# EAGLE schematic Ferrofluid Speaker v27 (EAGLE 9.7.0)
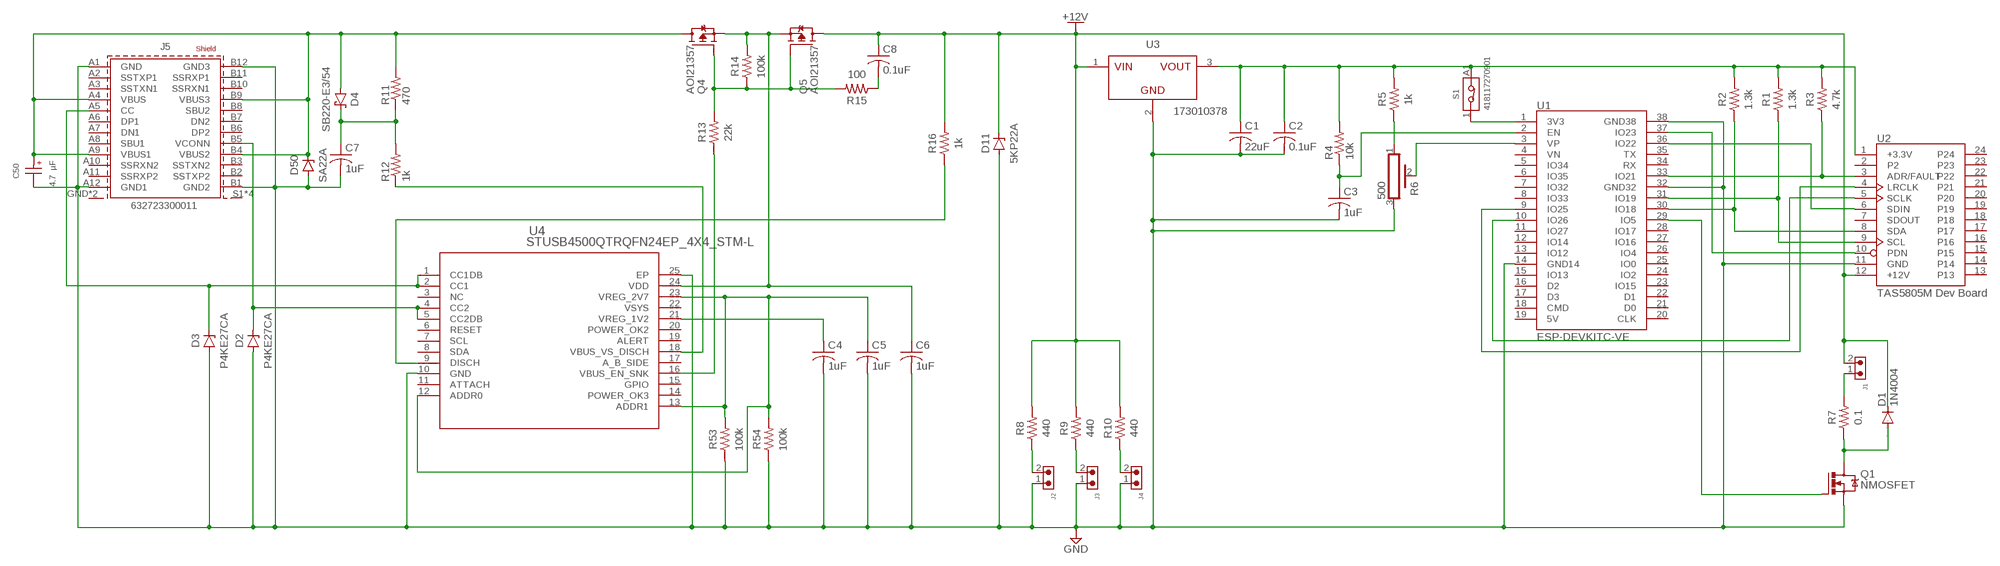
[diagram p0: schematic, sheet 1]

## Parts
C1  22uF  C-US025-024X044  [C025-024X044]
C2  0.1uF  C-US025-024X044  [C025-024X044]
C3  1uF  C-US025-024X044  [C025-024X044]
C4  1uF  C-US025-024X044  [C025-024X044]
C5  1uF  C-US025-024X044  [C025-024X044]
C6  1uF  C-US025-024X044  [C025-024X044]
C7  1uF  C-US025-024X044  [C025-024X044]
C8  0.1uF  C-US025-024X044  [C025-024X044]
C50  4.7 µF  WCAP-ATG8_5X11_860010472001  [WCAP-ATG8_5X11(DXL)]
D1  1N4004  [DO41-10]
D2  P4KE27CA  ZENERDO-214AB(SMC)  [DIOM7959X625N]
D3  P4KE27CA  ZENERDO-214AB(SMC)  [DIOM7959X625N]
D4  SB220-E3/54  SCHOTTKY_MBR0520LT1GDO-219  [SODFL3718X115]
D11  5KP22A  ZENERDO-214AB(SMC)  [DIOM7959X625N]
D50  SA22A  ZENERDO-214AB(SMC)  [DIOM7959X625N]
J1  6490XX11122_64900211122  [64900211122]
J2  6490XX11122_64900211122  [64900211122]
J3  6490XX11122_64900211122  [64900211122]
J4  6490XX11122_64900211122  [64900211122]
J5  632723300011  632723300011  [632723300011]
Q1  NMOSFET  NMOSFET_TO220  [TO220BV]
Q4  AOI21357  SPP80P06P  [TO220]
Q5  AOI21357  SPP80P06P  [TO220]
R1  1.3k  R-US_AXIAL-7.2MM-PITCH  [RESAD724W46L381D178B]
R2  1.3k  R-US_AXIAL-7.2MM-PITCH  [RESAD724W46L381D178B]
R3  4.7k  R-US_AXIAL-7.2MM-PITCH  [RESAD724W46L381D178B]
R4  10k  R-US_0204/5  [0204/5]
R5  1k  R-US_AXIAL-7.2MM-PITCH  [RESAD724W46L381D178B]
R6  500  PV36Z  [PV36Z]
R7  0.1  R-US_AXIAL-7.2MM-PITCH  [RESAD724W46L381D178B]
R8  440  R-US_AXIAL-7.2MM-PITCH  [RESAD724W46L381D178B]
R9  440  R-US_AXIAL-7.2MM-PITCH  [RESAD724W46L381D178B]
R10  440  R-US_AXIAL-7.2MM-PITCH  [RESAD724W46L381D178B]
R11  470  R-US_0204/5  [0204/5]
R12  1k  R-US_0204/5  [0204/5]
R13  22k  R-US_AXIAL-7.2MM-PITCH  [RESAD724W46L381D178B]
R14  100k  R-US_AXIAL-7.2MM-PITCH  [RESAD724W46L381D178B]
R15  100  R-US_AXIAL-7.2MM-PITCH  [RESAD724W46L381D178B]
R16  1k  R-US_AXIAL-7.2MM-PITCH  [RESAD724W46L381D178B]
R53  100k  R-US_AXIAL-7.2MM-PITCH  [RESAD724W46L381D178B]
R54  100k  R-US_AXIAL-7.2MM-PITCH  [RESAD724W46L381D178B]
S1  418117270901  [418117270901]
U1  ESP-DEVKITC-VE  ESP32-DEVKITC-VE  [ESP32-DEVKITC-VE]
U2  TAS5805M Dev Board  TAS5805M_DEV  [TAS5805M_DEV]
U3  173010378  MAGI³C-FDSM_SIP-3_173010378_173010X78  [MAGI³C-FDSM_173010X78]
U4  STUSB4500QTRQFN24EP_4X4_STM-L  [QFN24EP_4X4_STM-L]

## Nets
+3.3V: C1.1 C2.1 R1.2 R2.2 R3.2 R4.2 R5.2 S1.A1 U2.1(+3.3V) U3.3(VOUT)
+12V: C8.1 D1.C D11.1(C) J1.2 Q5.2(D) R8.2 R9.2 R10.2 R16.2 U2.12(+12V) U3.1(VIN)
ADR/FAULT: R3.1 U1.33(IO21) U2.3(ADR/FAULT)
CC1: D3.1(C) J5.A5(CC) U4.1(CC1DB) U4.2(CC1)
CC2: D2.1(C) J5.B5(VCONN) U4.4(CC2) U4.5(CC2DB)
DISCH: R16.1 U4.9(DISCH)
GND: C1.2 C2.2 C3.2 C4.2 C5.2 C6.2 C7.2 C50.2(-) D2.2(A) D3.2(A) D11.2(A) D50.2(A) J2.1 J3.1 J4.1 J5.A1(GND) J5.A12(GND1) J5.B1(GND2) J5.B12(GND3) Q1.S R6.3 R53.1 R54.1 U1.14(GND14) U1.32(GND32) U1.38(GND38) U2.11(GND) U3.2(GND) U4.10(GND) U4.25(EP)
LRCLK: U1.9(IO25) U2.4(LRCLK)
MAGLEFT: Q1.G U1.29(IO5)
N$1: C3.1 R4.1 U1.2(EN)
N$2: D1.A Q1.D R7.1
N$3: J2.2 R8.1
N$4: J3.2 R9.1
N$5: S1.1 U1.1(3V3)
N$6: R5.1 R6.1
N$7: R6.2 U1.3(VP)
N$8: J1.1 R7.2
N$9: J4.2 R10.1
N$10: C4.1 U4.21(VREG_1V2)
N$11: C8.2 R15.1
N$12: C7.1 D4.1(C) R11.1 R12.2
N$14: Q4.1(G) Q5.1(G) R13.2 R14.1 R15.2
N$15: R13.1 U4.16(VBUS_EN_SNK)
PDN: U1.37(IO23) U2.10(PDN)
SCL: R1.1 U1.31(IO19) U2.9(SCL)
SCLK: U1.10(IO26) U2.5(SCLK)
SDA: R2.1 U1.30(IO18) U2.8(SDA)
SDIN: U1.36(IO22) U2.6(SDIN)
VBUS: C50.1(+) D4.2(A) D50.1(C) J5.A4(VBUS) J5.A9(VBUS1) J5.B4(VBUS2) J5.B9(VBUS3) Q4.2(D) R11.2
VBUS_VS_DISCH: R12.1 U4.18(VBUS_VS_DISCH)
VDD: C6.1 Q4.3(S) Q5.3(S) R14.2 U4.24(VDD)
VREG_2V7: C5.1 R53.2 R54.2 U4.12(ADDR0) U4.13(ADDR1) U4.23(VREG_2V7)
Unconnected: J5.A2(SSTXP1) J5.A3(SSTXN1) J5.A6(DP1) J5.A7(DN1) J5.A8(SBU1) J5.A10(SSRXN2) J5.A11(SSRXP2) J5.B2(SSTXP2) J5.B3(SSTXN2) J5.B6(DP2) J5.B7(DN2) J5.B8(SBU2) J5.B10(SSRXN1) J5.B11(SSRXP1) J5.GND1(SHIELD) J5.GND(SHIELD) J5.S1(SHIELD1) J5.S2(SHIELD1) J5.S3(SHIELD1) J5.S4(SHIELD1) U1.4(VN) U1.5(IO34) U1.6(IO35) U1.7(IO32) U1.8(IO33) U1.11(IO27) U1.12(IO14) U1.13(IO12) U1.15(IO13) U1.16(D2) U1.17(D3) U1.18(CMD) U1.20(CLK) U1.21(D0) U1.22(D1) U1.23(IO15) U1.24(IO2) U1.25(IO0) U1.26(IO4) U1.27(IO16) U1.28(IO17) U1.34(RX) U1.35(TX) U2.2 U2.7(SDOUT) U2.13 U2.14 U2.15 U2.16 U2.17 U2.18 U2.19 U2.20 U2.21 U2.22 U2.23 U2.24 U4.3(NC) U4.6(RESET) U4.7(SCL) U4.8(SDA) U4.11(ATTACH) U4.14(POWER_OK3) U4.15(GPIO) U4.17(A_B_SIDE) U4.19(ALERT) U4.20(POWER_OK2)

## Power pins joined to a net without a drawn wire
5V: U1.19(5V)
VSYS: U4.22(VSYS)

## Library data of the parts
C1-C8 = rcl:C-US: CAPACITOR, American symbol; SPICEPREFIX: C
C50 = Wurth_Capacitors_WCAP-ATG8:WCAP-ATG8_5X11: WCAP-ATG8 Aluminium Electrolytic Capacitors General Purpose +85 °C Characteristics General purpose product series with max. operating temperature of +85 °C Wide range of capacitance value Mounting style: THT Radial Capacitance range: 0.1 µF ‒ 33000 µF Capacitance tolerance: ±20 % Voltage range (UR): 10 ‒ 400 V(DC) Operating temperature: -40 °C up to +85 °C for UR < 400 V(DC) -25 °C up to +85 °C for UR ≥ 400 V(DC) Endurance: 2000 h @ +85 °C Dimensions (DxL) in mm: 5.0 x 11.0 up to 22.0 x 51.0 Recommended soldering: Wave soldering Applications Filtering Smoothing Energy storage Coupling <https://www.we-online.com/catalog/media/o35732v209%20WCAP-ATG8_4C.jpg> Details see: https://www.we-online.com/catalog/en/WCAP-ATG8/ Updated by yingchun,Shan;2020-02-27 2020(C) Würth Elektronik; DATASHEET-URL: https://www.we-online.com/catalog/datasheet/860010472001.pdf; DF: 14%; DIAMETER: 5mm; I-LEAK: 3uA; I-RIPPLE: 34mA; L: 11mm; OPERATING-TEMPERATURE: -40 °C up to +85 °C; PART-NUMBER: 860010472001; PITCH: 2mm; TECHNICAL-REFERENCE: ATBC1104R7M025DSPA3B000; VR: 25V(DC)
D1 = Diode:1N4004: DIODE general purpose rectifier, 1 A
D2 D3 D50 = Diode:ZENER: Zener Diode - Generic; CATEGORY: Diode; SUB-CATEGORY: Zener; VALUE: ZENER
D4 = Diode:SCHOTTKY_: Schottky Diode - Popular parts; CATEGORY: Diode; DESCRIPTION: DIODE SCHOTTKY 20V 500MA SOD123; MANUFACTURER: Vishay General Semiconductor - Diodes Division; MPN: SB220-E3/54; SUB-CATEGORY: Schottky; VALUE: MBR0520LT1G
D11 = Diode:ZENER: Zener Diode - Generic; CATEGORY: Diode; MANUFACTURER: Littelfuse Inc.; MPN: 5KP22A; SUB-CATEGORY: Zener; VALUE: ZENER
J1-J4 = Wurth_Connectors_WR-MPC4:6490XX11122_64900211122: WR- MPC4 4.20 mm Male Single Row Vertical Header KIND PROPERTIES: Pitch:4.2 mm Gender:Male MATERIAL PROPERTIES: Insulator Material :PA66 Insulator Flammability Rating:UL94 V-0 Insulator Color:White Contact Material:Copper Alloy Contact Plating:Tin Contact Type:Stamped GENERAL INFORMATION Operating Temperature:-40 up to +105 °C Working Voltage:600V (AC) Withstanding Voltage:1500 V (AC) Contact Resistance:10 mΩ RISO:1000 MΩ PACKAGING PROPERTIES Packaging:Tray <https://katalog.we-online.com/media/images/v2/o33185v209%20Family_WR-MPC4_6490xx11122.jpg> Details see: https://katalog.we-online.com/en/em/MPC4_4_20_MALE_SINGLE_ROW_VERTICAL_HEADER_6490XX11122 Updated by Yingchun,Shan 2019-11-12 2019 (C) Würth Elektronik; CONTACT-RESISTANCE: 10mOhm; DATASHEET-URL: https://www.we-online.com/catalog/datasheet/64900211122.pdf; GENDER: Male; L: 9.6mm; MATE-WITH: WR-MPC4 4.20 mm Female Single Row Plug; MOUNT: THT; PACKAGING: Tray; PART-NUMBER: 64900211122; PCB-CABLE-PANEL: PCB; PINS: 2; PITCH: 4.2mm; ROWS: Single; TOL-R: max.; TYPE: Vertical; WORKING-VOLTAGE: 600V(AC)
J5 = Wurth_Connectors_WR-USB:632723300011: WR-COM USB 3.1 Type C Receptacle Horizontal THT/SMT Kind Properties Durability:10 000 Mating cycles Connector Type:USB 3.1 Type C Gender:Receptacle Type:Horizontal General Information Operating Temperature:-40up to +105 °C Compliance:RoHS Electrical Properties Working Voltage:20V (DC) Withstanding Voltage:100V (AC) Contact Resistance:30 mΩ Material Properties Insulator Material:LCP Insulator Flammability Rating:UL94 V-0 Color:Black Contact Material:Brass Contact Plating:2µ” Gold over 30µ” Pd-Ni Contact Type:Stamped Shielding Material:Steel Shielding Plating:Matte Tin <https://www.we-online.com/catalog/media/o144501v209%20Family_WR-COM_632723x00011.jpg> Details see: https://www.we-online.com/catalog/en/COM_3_1_THR_SMT_TYPE_C_RECEPTACLE_HORIZONTAL/ Updated by Ella Wu 2021-09-28 2021 (C) Würth Elektronik; APPLICATION: USB 3.1; DATASHEET-URL: https://www.we-online.com/redexpert/spec/632723300011 ?ae; GERDER: Receptacle; INTERFACE-TYPE: Type C; IR: 5A; MOUNT: THR; PACKAGING: Tape and Reel; PART-NUMBER: 632723300011; PINS: 24; TYPE: Horizontal; WORKING-VOLTAGE: 20V(DC)
Q1 = Transistor:NMOSFET: N-Channel MOSFET - Generic; CATEGORY: Transistor; SUB-CATEGORY: MOSFET; TYPE: N-Channel
Q4 Q5 = transistor-fet:SPP80P06P: SIPMOS(R) Power-Transistor P-Channel, Enhancement mode Source: http://www.infineon.com/upload/Document/cmc_upload/documents/012/3619/SPP80P06P.pdf
R1-R3 R5 R7-R10 R13-R16 R53 R54 = Resistor:R-US: Resistor Fixed - ANSI; CATEGORY: Resistor; SUB-CATEGORY: Fixed
R4 R11 R12 = rcl:R-US_: RESISTOR, American symbol; SPICEPREFIX: R
R6 = Resistor:PV36: Rectangular Trimmer Potentiometers - PV36 Series Datasheet <https://www.bourns.com/docs/Product-Datasheets/pv36.pdf>; CATEGORY: Resistor; DESCRIPTION: Lead Sealed Type Multiturn PV36 Series; MANUFACTURER: BOURNS; MPN: PV36Z; OPERATING_TEMPERATURE: -55 to +125 °C; PART_STATUS: Active; ROHS_COMPLIANCE: RoHS Compliant; SERIES: PV36; SUB-CATEGORY: Trimpot; TYPE: Lead Sealed
S1 = Wurth_Switch_WS-DITV:418117270901: WS-DITV Compact THT with Raised Actuator 2.54 mm Mechanical Properties Operation Force:800 g Electrical Life:2000 Cycles Actuator Type:Raise Type Properties IR:25 mA VR:24 V (DC) IR:100 mA VR:50 V (DC) Contact Resistance Initial:50 mΩ Contact Resistance After Life Test:100 mΩ RISO:100 MΩ Withstanding Voltage:500 V (AC) Actuator Type:Raise Type Switch Position:Off Material Properties Cover Material:PBT Cover Flammability Rating:UL94 V-0 Cover Color:Red Base Material:PBT Base Flammability Rating:UL94 V-0 Base Color:Black Actuator Material:PBT Actuator Flammability Rating:UL94 V-0 Actuator Color:White Contact Material:Copper Alloy Contact Plating:Gold Terminal Material:Copper Alloy Terminal Plating:Gold General Information Operating Temperature:-40 up to +85 °C Packaging Properties Packaging:Tube <https://www.we-online.com/catalog/media/o60896v209%20DITV_418117270908A_gruppe.jpg> Details see: https://www.we-online.com/catalog/en/DITV_2_54_COMPACT_THT_WITH_RAISED_ACTUATOR/ Updated by Yingchun, Shan 2020-01-22 2020 (C) Würth Elektronik; DATASHEET-URL: https://www.we-online.com/catalog/datasheet/418117270901.pdf; PART-NUMBER: 418117270901; PINS: 1; QTY: 130
U1 = Adam Part Library:ESP32-DEVKITC-VE
U2 = Adam Part Library:TAS5805M_DEV
U3 = Wurth_Step Down Converter_MagI³C-FDSM:MAGI³C-FDSM_SIP-3: MagI³C-FDSM Fixed Step Down Regulator Module Characteristics Simplest design (no power supply knowledge required) Leaded through-hole package for easy manufacturing and prototyping Stand alone solution (CIN and COUT integrated, no external components) L78x series linear regulator replacement (no heatsink required) Low conducted and radiated EMI (compliant to EN55022 class B) Applications Point-of-Load from 24V, 18V, 15V, 12V, 9V rail Replacement for linear regulators Interface and microcontroller supply Industrial, Test & Measurement, Medical applications System power supplies <https://www.we-online.com/catalog/media/o55808v209%20Family_FDSM_NEU.jpg> Details see: https://www.we-online.com/catalog/en/MAGIC_FDSM_FIXED_OUTPUT_VOLTAGE Updated by Ella Wu 2022-01-21 2022 (C) Würth Elektronik; DATASHEET-URL: https://www.we-online.de/katalog/datasheet/173010378.pdf; HEIGHT: 10.5mm; I-OUTPUT: 1A; LENGTH: 11.6mm; MOUNT: THT; PART-NUMBER: 173010378; V-INPUT: 7 - 28V; V-OUTPUT: 3.3V; WIDTH: 8.5mm
U4 = 2022-09-25_15-58-04_Library:STUSB4500QTR; COPYRIGHT: Copyright (C) 2022 Ultra Librarian. All rights reserved.; MANUFACTURER_PART_NUMBER: STUSB4500QTR; MFR_NAME: STMicroelectronics